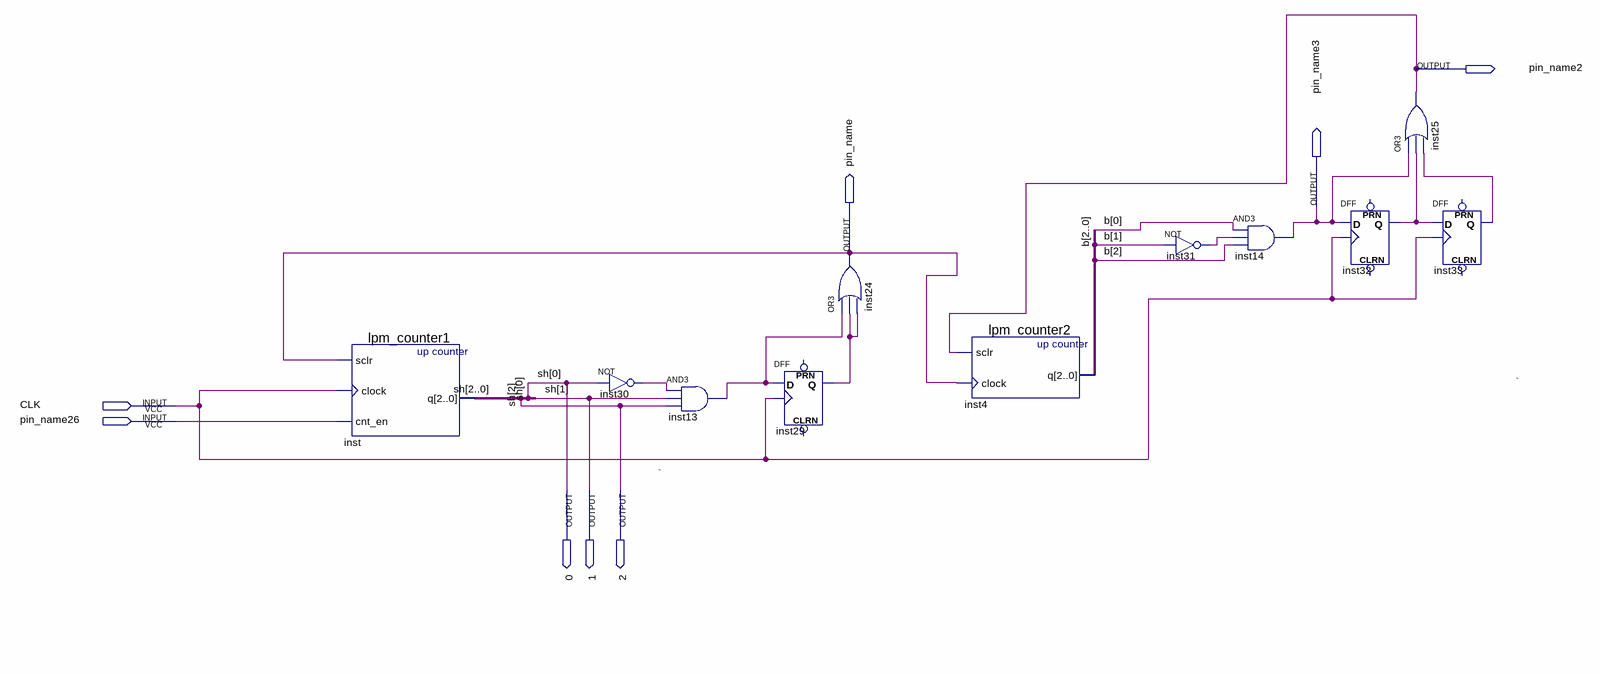
[diagram p0: schematic sheet]
// Quartus schematic LAB2.bdf as structural Verilog: 11 symbols, 8 pins
module LAB2 (
  input  CLK,
  input  pin_name26,
  output pin_name2,
  output pin_name3,
  output pin_name,
  output \0 ,
  output \1 ,
  output \2 
);

  wire inst13_out, inst29_q, inst30_out, inst31_out, inst32_q, inst33_q;
  wire [2:0] b;

  lpm_counter1 inst (.sclr(pin_name), .clock(CLK), .cnt_en(pin_name26), .q({\2 , \1 , \0 }));
  not inst30 (inst30_out, \0 );
  and inst13 (inst13_out, inst30_out, \1 , \2 );
  DFF inst29 (.CLK(CLK), .D(inst13_out), .Q(inst29_q));  // open: CLRN, PRN
  or inst24 (pin_name, inst13_out, inst29_q, inst29_q);
  lpm_counter2 inst4 (.sclr(pin_name2), .clock(pin_name), .q(b));
  not inst31 (inst31_out, b[1]);
  and inst14 (pin_name3, b[0], inst31_out, b[2]);
  DFF inst32 (.CLK(CLK), .D(pin_name3), .Q(inst32_q));  // open: CLRN, PRN
  or inst25 (pin_name2, pin_name3, inst32_q, inst33_q);
  DFF inst33 (.CLK(CLK), .D(inst32_q), .Q(inst33_q));  // open: CLRN, PRN

  // Other names for the same wires on the sheet: sh[2:0] = {\2 , \1 , \0 }

  // Notes on the sheet:
  //   `
  //   `
endmodule
